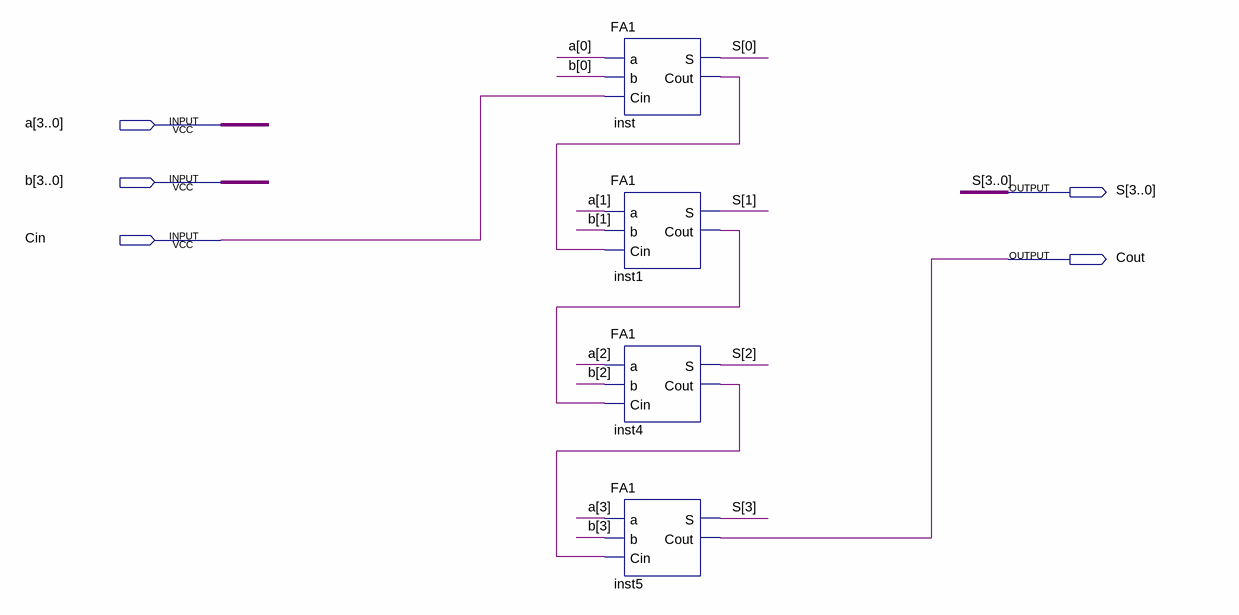
[diagram p0: schematic sheet]
// Quartus schematic FA4.bdf as structural Verilog: 4 symbols, 5 pins
module FA4 (
  input  [3:0] a,
  input  [3:0] b,
  input  Cin,
  output [3:0] S,
  output Cout
);

  wire inst1_cout, inst4_cout, inst_cout;

  FA1 inst (.a(a[0]), .b(b[0]), .Cin(Cin), .S(S[0]), .Cout(inst_cout));
  FA1 inst1 (.a(a[1]), .b(b[1]), .Cin(inst_cout), .S(S[1]), .Cout(inst1_cout));
  FA1 inst4 (.a(a[2]), .b(b[2]), .Cin(inst1_cout), .S(S[2]), .Cout(inst4_cout));
  FA1 inst5 (.a(a[3]), .b(b[3]), .Cin(inst4_cout), .S(S[3]), .Cout(Cout));
endmodule
